# EAGLE design power_supply(iteration3) (EAGLE 9.6.2)
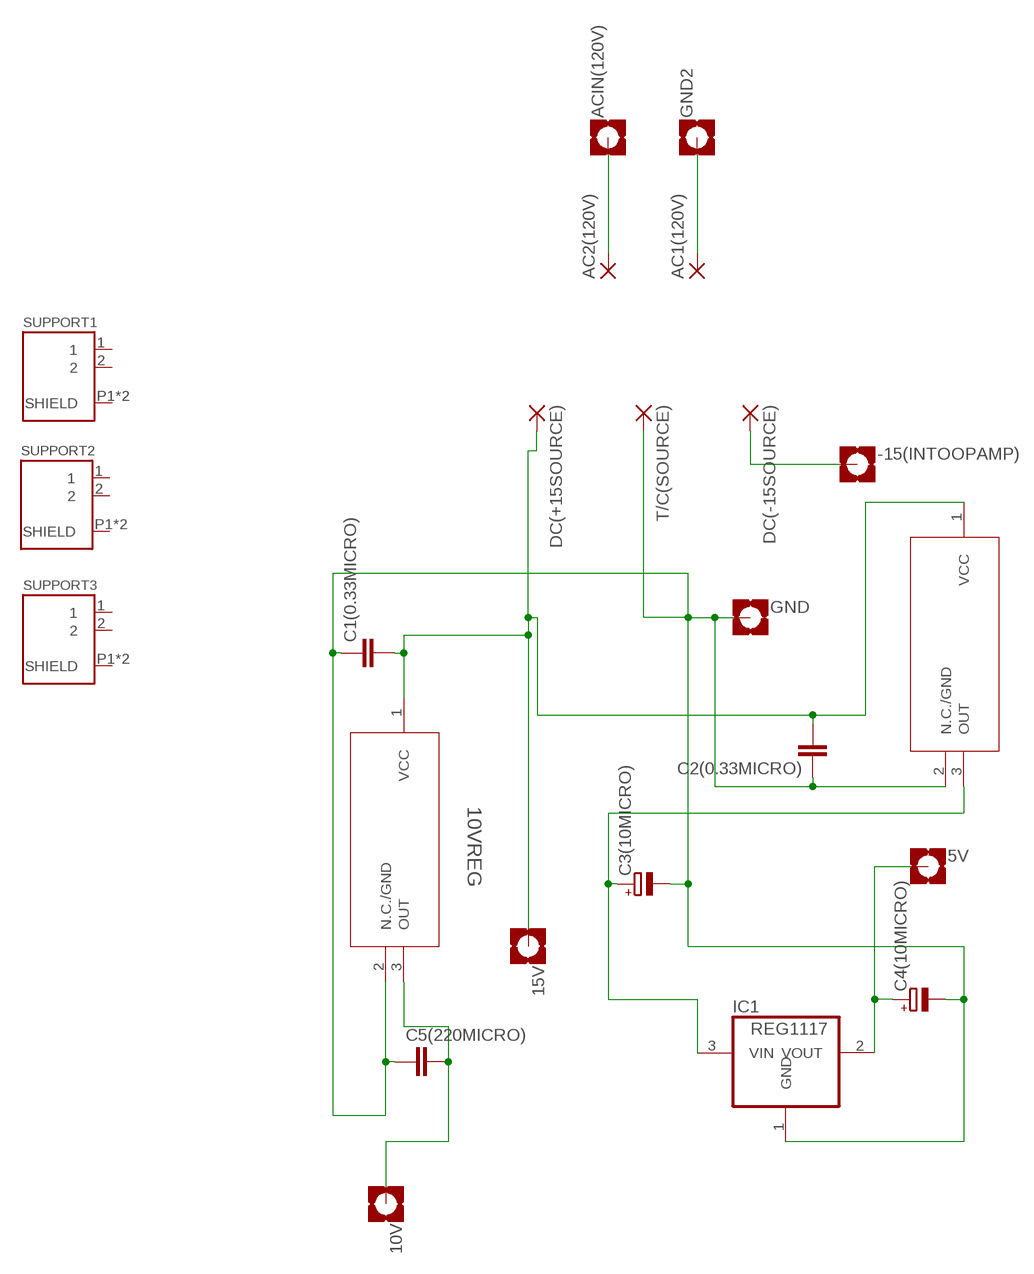
[diagram p0: schematic, sheet 1]

## Parts
5V  MOUNT-PAD-SQUARE2.8  [2,8-PAD-SQUARE]
10V  MOUNT-PAD-SQUARE2.8  [2,8-PAD-SQUARE]
10VREG  BAJ0BC0T  [TO220FP-3_ROM]
10VREG1  BAJ0BC0T  [TO220FP-3_ROM]
15V  MOUNT-PAD-SQUARE2.8  [2,8-PAD-SQUARE]
-15(INTOOPAMP)  MOUNT-PAD-SQUARE2.8  [2,8-PAD-SQUARE]
AC1(120V)  3,81/1,4  [3,81/1,4]
AC2(120V)  3,81/1,4  [3,81/1,4]
ACIN(120V)  MOUNT-PAD-SQUARE2.8  [2,8-PAD-SQUARE]
C1(0.33MICRO)  C-EU025-025X050  [C025-025X050]
C2(0.33MICRO)  C-EU025-025X050  [C025-025X050]
C3(10MICRO)  CPOL-EUE2.5-6  [E2,5-6]
C4(10MICRO)  CPOL-EUE2.5-6  [E2,5-6]
C5(220MICRO)  C-EUC1812K  [C1812K]
DC(+15SOURCE)  3,81/1,4  [3,81/1,4]
DC(-15SOURCE)  3,81/1,4  [3,81/1,4]
GND  MOUNT-PAD-SQUARE2.8  [2,8-PAD-SQUARE]
GND2  MOUNT-PAD-SQUARE2.8  [2,8-PAD-SQUARE]
IC1  REG1117  [SOT223_HEATSINK]
SUPPORT1  1-1337543-0  [CONN_1-1337543-0]
SUPPORT2  1-1337543-0  [CONN_1-1337543-0]
SUPPORT3  1-1337543-0  [CONN_1-1337543-0]
T/C(SOURCE)  3,81/1,4  [3,81/1,4]

## Nets
N$1: 10VREG1.1(VCC) 10VREG.1(VCC) 15V.B2,8(MOUNT) C1(0.33MICRO).2 C2(0.33MICRO).2 DC(+15SOURCE).1(P)
N$3: 10V.B2,8(MOUNT) 10VREG.3(OUT) C5(220MICRO).2
N$4: AC2(120V).1(P) ACIN(120V).B2,8(MOUNT)
N$5: 10VREG1.3(OUT) C3(10MICRO).+ IC1.3(VIN)
N$6: AC1(120V).1(P) GND2.B2,8(MOUNT)
N$8: -15(INTOOPAMP).B2,8(MOUNT) DC(-15SOURCE).1(P)
N$9: 10VREG1.2(N.C./GND) 10VREG.2(N.C./GND) C1(0.33MICRO).1 C2(0.33MICRO).1 C3(10MICRO).- C4(10MICRO).- C5(220MICRO).1 GND.B2,8(MOUNT) IC1.1(GND) T/C(SOURCE).1(P)
N$10: 5V.B2,8(MOUNT) C4(10MICRO).+ IC1.2(VOUT)
Unconnected: SUPPORT1.1 SUPPORT1.2 SUPPORT1.P1(SHIELD) SUPPORT1.P2(SHIELD) SUPPORT2.1 SUPPORT2.2 SUPPORT2.P1(SHIELD) SUPPORT2.P2(SHIELD) SUPPORT3.1 SUPPORT3.2 SUPPORT3.P1(SHIELD) SUPPORT3.P2(SHIELD)

## Library data of the parts
5V 10V 15V -15(INTOOPAMP) ACIN(120V) GND GND2 = holes:MOUNT-PAD-SQUARE: MOUNTING PAD, square
10VREG 10VREG1 = scipt_lib:BAJ0BC0T; BUILT_BY: EMA_Molly; COPYRIGHT: Copyright (C) 2018 Accelerated Designs. All rights reserved; MANUFACTURER_PART_NUMBER: BAJ0BC0T; SOURCELIBRARY: ROHM_2019-10-21; VENDOR: ROHM Semiconductor
AC1(120V) AC2(120V) DC(+15SOURCE) DC(-15SOURCE) T/C(SOURCE) = wirepad:3,81/1,4: THROUGH-HOLE PAD
C1(0.33MICRO) C2(0.33MICRO) C5(220MICRO) = rcl:C-EU: CAPACITOR, European symbol; SPICEPREFIX: C
C3(10MICRO) C4(10MICRO) = rcl:CPOL-EU: POLARIZED CAPACITOR, European symbol; SPICEPREFIX: C
IC1 = burr-brown-3:REG1117: 800mA and 1A Low Dropout (LDO) Positive Regulator 1.8V, 2.5V, 2.85V, 3.3V, 5V, and Adj
SUPPORT1-SUPPORT3 = jayich_lab_eagle_library:1-1337543-0: BNC appliance socket, right angle [TE Connectivity] 1-1337543-0 BNC appliance socket, right angle; COMMENT: 1-1337543-0; DESCRIPTION: BNC Ins R/A PCB Skt 50Ohm White; DIGI-KEY_PART_NUMBER: A97553-ND; DIGI-KEY_PURCHASE_URL: https://www.digikey.com/product-detail/en/te-connectivity-amp-connectors/1-1337543-0/A97553-ND/1755940?utm_source=snapeda&utm_medium=aggregator&utm_campaign=symbol; MF: TE Connectivity; MP: 1-1337543-0; NUMBER_OF_POSITIONS: 1; PACKAGE: None; TE_PURCHASE_URL: https://www.te.com/usa-en/product-1-1337543-0.html?te_bu=Cor&te_type=disp&te_campaign=seda_glo_cor-seda-global-disp-prtnr-fy19-seda-model-bom-cta_sma-317_1&elqCampaignId=32493

## Board
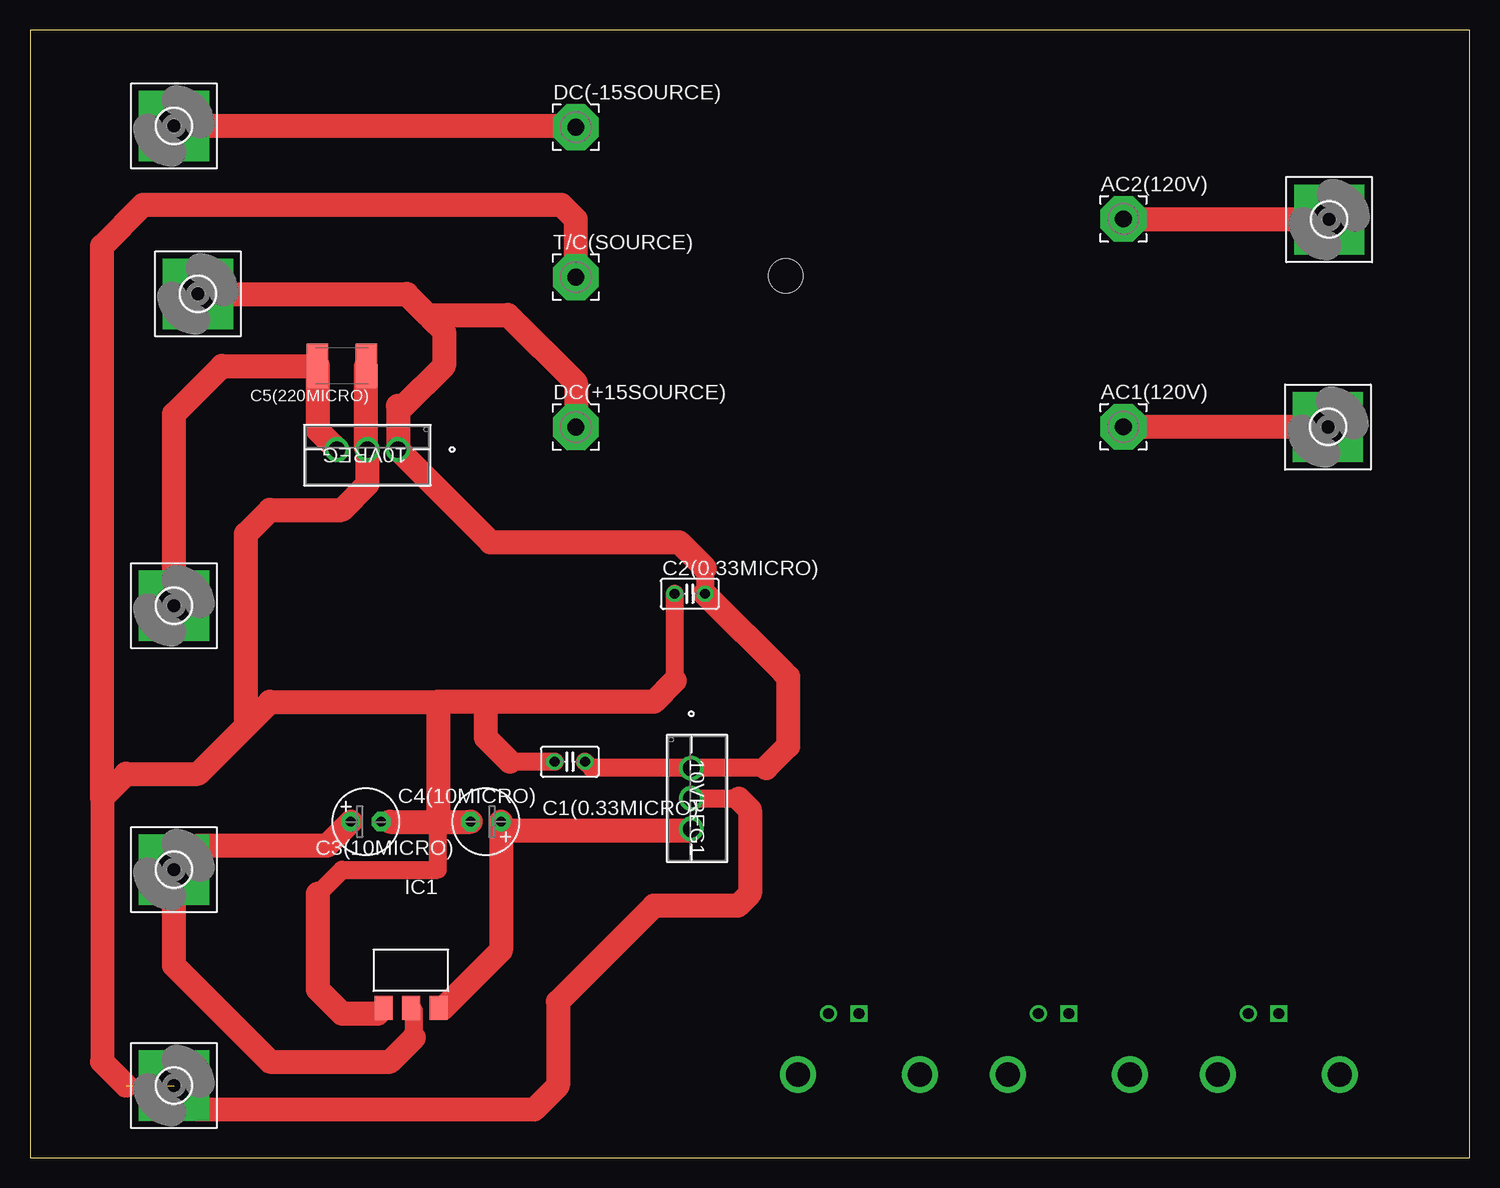
[diagram p1: board, top side]
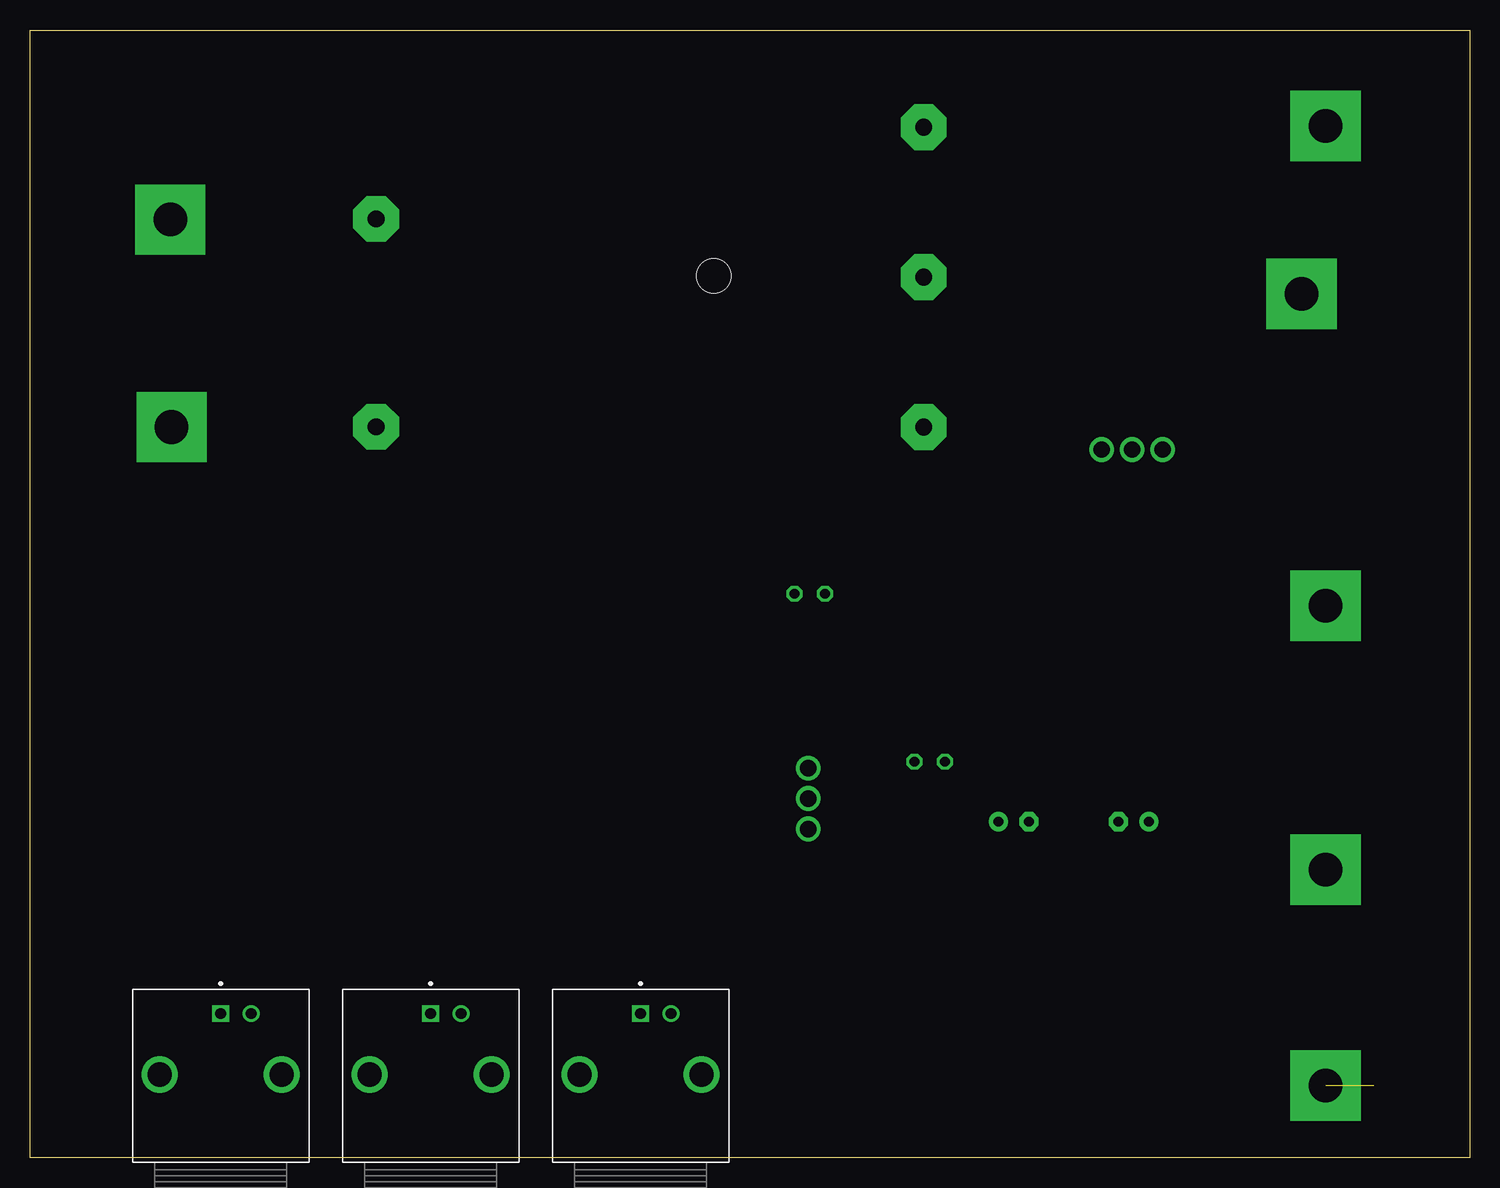
[diagram p2: board, bottom side, seen from below]

Size 120 x 94 mm. Coordinates in mm from the lower left corner, seen from the top.
Outline: 0,0 120,0 120,94 0,94 0,0
Copper layers (1*16): Top 0.035mm / dielectric 1.5mm / Bottom 0.035mm
Design rules "default": minimum track width 6mil, minimum drill 0.35mm, track to track 6mil, track to pad 6mil, pad to pad 6mil, via to via 6mil, smd to smd 6mil, copper to edge 40mil, drill to drill 6mil, minimum pad ring 10mil, minimum via ring 8mil, stop-mask expansion 4mil, vias tented up to drill 0mil, thermal gap 10mil
Holes 2.86 mm at 63,73.5

### Footprints (pad centres in the part's own frame; a part is rotated, then mirrored left to right if it is on the bottom)
2,8-PAD-SQUARE = drill 2.8 pad 5.842 square: B2,8 0,0
TO220FP-3_ROM = drill 1.372 pad 1.88: 1 0,0; 2 2.54,0; 3 5.08,0
3,81/1,4 = drill 1.397 pad 3.81 octagon: 1 0,0
C025-025X050 = drill 0.813 octagon: 1 -1.27,0; 2 1.27,0
E2,5-6 = drill 0.813 pad 1.6: + -1.27,0 | drill 0.813 pad 1.6 octagon: - 1.27,0
C1812K = smd 1.8 x 3.7: 1 -2.05,0; 2 2.05,0
SOT223_HEATSINK = smd 1.499 x 2.007: 1 -2.261,-3.15; 2 0.025,-3.15; 3 2.311,-3.15
CONN_1-1337543-0 = drill 0.89 square: 1 0,0 | drill 0.89: 2 0,-2.54 | drill 2.01: P1 -5.08,-5.08; P2 -5.08,5.08

### Placement (x,y rotation side)
5V  12,24 0 top
10V  12,46 0 top
10VREG  30.67,59.02 180 top
10VREG1  55.13,32.47 270 top
15V  14,72 0 top
-15(INTOOPAMP)  12,86 0 top
AC1(120V)  91.15,60.92 0 top
AC2(120V)  91.15,78.25 0 top
ACIN(120V)  108.3,78.2 0 top
C1(0.33MICRO)  45,33 0 top
C2(0.33MICRO)  55,47 0 top
C3(10MICRO)  38,28 180 top
C4(10MICRO)  28,28 0 top
C5(220MICRO)  26,66 180 top
DC(+15SOURCE)  45.5,60.9 0 top
DC(-15SOURCE)  45.5,85.9 0 top
GND  12,6 0 top
GND2  108.2,60.9 0 top
IC1  31.75,15.62 0 top
SUPPORT1  69.1,12 90 bottom
SUPPORT2  86.6,12 90 bottom
SUPPORT3  104.1,12 90 bottom
T/C(SOURCE)  45.5,73.4 0 top

### Tracks (layer width: path | path; a pad name or v marks a point on that pad's centre or on a via)
N$1
  Top 0.152: 31.17,62.67 30.67,62.67 | 33.15,70.25 33.4,70 | 62.84,40.44 63.2,40.07
  Top 1.5: 56.27,49.13 C2(0.33MICRO).2 | 61.37,32.47 10VREG1.1 46.8,32.47 C1(0.33MICRO).2
  Top 2: 30.67,62.67 10VREG.1 38.39,51.3 54.1,51.3 56.27,49.13 | C2(0.33MICRO).2 62.84,40.44 | 15V.B2,8 31.4,72 33.15,70.25 39.85,70.25 45.5,64.6 DC(+15SOURCE).1 | 33.4,70 34.5,68.9 34.5,66 31.17,62.67 | 63.2,40.07 63.2,34.3 61.37,32.47
N$3
  Top 0.152: 24,66 C5(220MICRO).2
  Top 2: 10V.B2,8 12,62 16,66 C5(220MICRO).2 | 10VREG.3 24,60.61 24,66
N$4
  Top 0.152: 108.25,78.25 ACIN(120V).B2,8
  Top 2: AC2(120V).1 108.25,78.25
N$5
  Top 0.152: 34.47,12.47 IC1.3 34.06,11.94 | 55,27.26 10VREG1.3 | C3(10MICRO).+ 40.01,27.26
  Top 2: C3(10MICRO).+ 39.27,17.27 34.47,12.47 | 40.01,27.26 55,27.26
N$6
  Top 0.152: 108.18,60.92 GND2.B2,8
  Top 2: AC1(120V).1 108.18,60.92
N$8
  Top 2: DC(-15SOURCE).1 45.4,86 -15(INTOOPAMP).B2,8
N$9  (1 unrouted)
  Top 0.152: 28.64,11.62 IC1.1 29.02,12 | 28,59.15 10VREG.2 28.13,58.13 | 28,65.95 C5(220MICRO).1 | C4(10MICRO).- 30,28
  Top 1.5: 24,22 26,24 34,24 34,28 | C2(0.33MICRO).1 53.73,39.73 | C1(0.33MICRO).1 40,33 | 10VREG1.2 59.07,29.93
  Top 2: GND.B2,8 14,4 42,4 44,6 44,13 52,21 59,21 60,22 60,29 59.07,29.93 | 6,30 8,32 14,32 18,36 | 28,59.15 28,65.95 | 6,30 6,8 8,6 | 30,28 34,28 | 34,28 C3(10MICRO).- | 29.02,12 26,12 24,14 24,22 | 18,36 20,38 34,38 | 6,30 6,76 9.4,79.4 44.3,79.4 45.5,78.2 T/C(SOURCE).1 | 18,36 18,52 20,54 26,54 28.13,56.13 10VREG.2 | 38,38 52,38 53.73,39.73 | 38,38 34,38 | 34,38 34,28 | 40,33 38,35 38,38
N$10
  Top 0.152: 32,12.25 IC1.2
  Top 1.5: 32,10 32,12.25
  Top 2: C4(10MICRO).+ 24.73,26 14,26 5V.B2,8 12,16 20,8 30,8 32,10